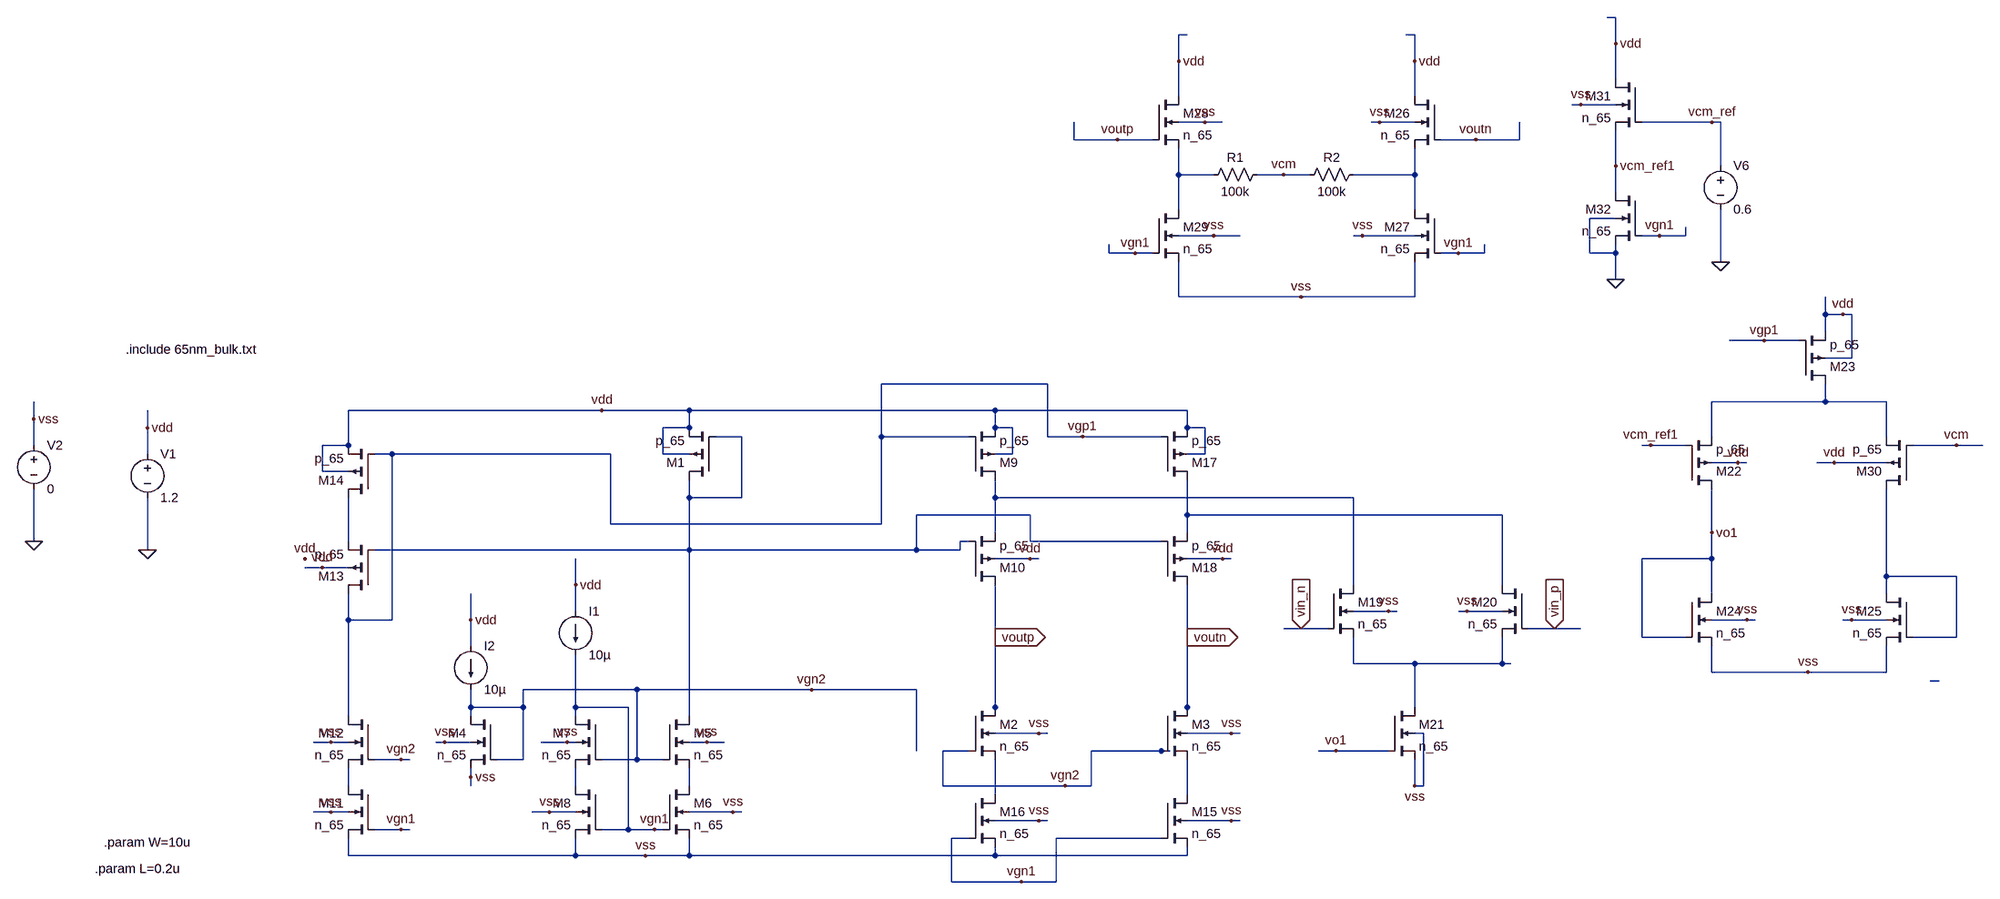
[diagram p0: schematic FC_OTA.asc]
FC_OTA.asc, the LTspice schematic file:
Version 4
SHEET 1 1988 1072
WIRE 1312 -944 1296 -944
WIRE 528 -912 512 -912
WIRE 944 -912 928 -912
WIRE 1312 -896 1312 -944
WIRE 512 -864 512 -912
WIRE 944 -864 944 -912
WIRE 1312 -832 1312 -896
WIRE 512 -800 512 -864
WIRE 944 -800 944 -864
WIRE 1248 -784 1232 -784
WIRE 1312 -784 1248 -784
WIRE 560 -752 512 -752
WIRE 592 -752 560 -752
WIRE 880 -752 864 -752
WIRE 944 -752 880 -752
WIRE 1488 -752 1360 -752
WIRE 1504 -752 1488 -752
WIRE 320 -720 320 -752
WIRE 400 -720 320 -720
WIRE 464 -720 400 -720
WIRE 1056 -720 992 -720
WIRE 1136 -720 1136 -752
WIRE 1136 -720 1056 -720
WIRE 1312 -672 1312 -736
WIRE 1504 -672 1504 -752
WIRE 512 -656 512 -704
WIRE 576 -656 512 -656
WIRE 704 -656 656 -656
WIRE 752 -656 704 -656
WIRE 944 -656 944 -704
WIRE 944 -656 832 -656
WIRE 1312 -624 1312 -672
WIRE 512 -592 512 -656
WIRE 944 -592 944 -656
WIRE 1312 -576 1264 -576
WIRE 576 -544 512 -544
WIRE 624 -544 576 -544
WIRE 848 -544 832 -544
WIRE 944 -544 848 -544
WIRE 1392 -544 1360 -544
WIRE 1440 -544 1440 -560
WIRE 1440 -544 1392 -544
WIRE 384 -512 384 -528
WIRE 432 -512 384 -512
WIRE 464 -512 432 -512
WIRE 1024 -512 992 -512
WIRE 1072 -512 1072 -528
WIRE 1072 -512 1024 -512
WIRE 1264 -512 1264 -576
WIRE 1312 -512 1312 -528
WIRE 1312 -512 1264 -512
WIRE 1504 -496 1504 -592
WIRE 1312 -464 1312 -512
WIRE 512 -432 512 -496
WIRE 736 -432 512 -432
WIRE 944 -432 944 -496
WIRE 944 -432 736 -432
WIRE 1696 -400 1696 -432
WIRE 1728 -400 1696 -400
WIRE 1744 -400 1728 -400
WIRE 1696 -368 1696 -400
WIRE 1584 -352 1520 -352
WIRE 1648 -352 1584 -352
WIRE 1744 -320 1744 -400
WIRE 1744 -320 1696 -320
WIRE 272 -272 -32 -272
WIRE 1696 -240 1696 -272
WIRE 1696 -240 1488 -240
WIRE 1808 -240 1696 -240
WIRE -544 -224 -1008 -224
WIRE -384 -224 -544 -224
WIRE 176 -224 -384 -224
WIRE 528 -224 176 -224
WIRE -1584 -208 -1584 -240
WIRE -1376 -192 -1376 -224
WIRE -384 -192 -384 -224
WIRE -384 -192 -432 -192
WIRE 176 -192 176 -224
WIRE 208 -192 176 -192
WIRE 528 -192 528 -224
WIRE 560 -192 528 -192
WIRE -288 -176 -336 -176
WIRE -32 -176 -32 -272
WIRE 128 -176 -32 -176
WIRE 272 -176 272 -272
WIRE 336 -176 272 -176
WIRE 480 -176 336 -176
WIRE 1488 -176 1488 -240
WIRE 1808 -176 1808 -240
WIRE -1584 -160 -1584 -208
WIRE -1008 -160 -1008 -224
WIRE -1008 -160 -1056 -160
WIRE 1376 -160 1360 -160
WIRE 1440 -160 1376 -160
WIRE 1936 -160 1856 -160
WIRE 1984 -160 1936 -160
WIRE -1376 -144 -1376 -192
WIRE -1008 -144 -1008 -160
WIRE -928 -144 -960 -144
WIRE -528 -144 -928 -144
WIRE -432 -144 -432 -192
WIRE -384 -144 -432 -144
WIRE 208 -144 208 -192
WIRE 208 -144 176 -144
WIRE 560 -144 560 -192
WIRE 560 -144 528 -144
WIRE 1536 -128 1488 -128
WIRE 1552 -128 1536 -128
WIRE 1712 -128 1680 -128
WIRE 1808 -128 1712 -128
WIRE -1056 -112 -1056 -160
WIRE -1008 -112 -1056 -112
WIRE -384 -64 -384 -96
WIRE -288 -64 -288 -176
WIRE -288 -64 -384 -64
WIRE 176 -64 176 -96
WIRE 832 -64 176 -64
WIRE 240 -32 32 -32
WIRE 528 -32 528 -96
WIRE 1104 -32 528 -32
WIRE -528 -16 -528 -144
WIRE -32 -16 -32 -176
WIRE -32 -16 -528 -16
WIRE 176 0 176 -64
WIRE 528 0 528 -32
WIRE 1488 0 1488 -80
WIRE -1584 16 -1584 -80
WIRE -1008 16 -1008 -64
WIRE 128 16 112 16
WIRE 240 16 240 -32
WIRE 480 16 240 16
WIRE -1376 32 -1376 -64
WIRE -384 32 -384 -64
WIRE -384 32 -960 32
WIRE 32 32 32 -32
WIRE 32 32 -384 32
WIRE 112 32 112 16
WIRE 112 32 32 32
WIRE 240 48 176 48
WIRE 256 48 240 48
WIRE 592 48 528 48
WIRE 608 48 592 48
WIRE 1488 48 1488 0
WIRE 1488 48 1360 48
WIRE -1056 64 -1088 64
WIRE -1008 64 -1056 64
WIRE 1808 80 1808 -80
WIRE 1936 80 1808 80
WIRE -592 96 -592 48
WIRE 832 96 832 -64
WIRE 1104 96 1104 -32
WIRE 1488 112 1488 48
WIRE 1808 112 1808 80
WIRE -592 144 -592 96
WIRE 896 144 832 144
WIRE 912 144 896 144
WIRE 1040 144 1024 144
WIRE 1104 144 1040 144
WIRE -1008 160 -1008 112
WIRE -928 160 -928 -144
WIRE -928 160 -1008 160
WIRE -784 160 -784 112
WIRE 1552 160 1488 160
WIRE 1568 160 1552 160
WIRE 1744 160 1728 160
WIRE 1808 160 1744 160
WIRE 736 176 704 176
WIRE 784 176 736 176
WIRE 1200 176 1152 176
WIRE 1248 176 1200 176
WIRE 176 192 176 96
WIRE 528 192 528 96
WIRE 1360 192 1360 48
WIRE 1440 192 1360 192
WIRE 1936 192 1936 80
WIRE 1936 192 1856 192
WIRE -784 208 -784 160
WIRE 832 240 832 192
WIRE 944 240 832 240
WIRE 1104 240 1104 192
WIRE 1104 240 944 240
WIRE 1120 240 1104 240
WIRE 1488 256 1488 208
WIRE 1664 256 1488 256
WIRE 1808 256 1808 208
WIRE 1808 256 1664 256
WIRE 1904 272 1888 272
WIRE -480 288 -688 288
WIRE -160 288 -480 288
WIRE 32 288 -160 288
WIRE -784 320 -784 288
WIRE -688 320 -688 288
WIRE -688 320 -784 320
WIRE -592 320 -592 224
WIRE -496 320 -592 320
WIRE 176 320 176 192
WIRE 528 320 528 192
WIRE 944 320 944 240
WIRE -1008 336 -1008 160
WIRE -784 336 -784 320
WIRE -592 336 -592 320
WIRE -384 336 -384 32
WIRE 176 336 176 320
WIRE 528 336 528 320
WIRE 256 368 176 368
WIRE 272 368 256 368
WIRE 608 368 528 368
WIRE 624 368 608 368
WIRE 960 368 944 368
WIRE -1040 384 -1072 384
WIRE -1008 384 -1040 384
WIRE -832 384 -848 384
WIRE -784 384 -832 384
WIRE -608 384 -656 384
WIRE -592 384 -608 384
WIRE -352 384 -384 384
WIRE -320 384 -352 384
WIRE 32 400 32 288
WIRE 128 400 80 400
WIRE 480 400 352 400
WIRE 496 400 480 400
WIRE 800 400 768 400
WIRE 896 400 800 400
WIRE -912 416 -960 416
WIRE -896 416 -912 416
WIRE -688 416 -688 320
WIRE -688 416 -736 416
WIRE -480 416 -480 288
WIRE -480 416 -544 416
WIRE -432 416 -480 416
WIRE -784 448 -784 432
WIRE -1008 464 -1008 432
WIRE -784 464 -784 448
WIRE -592 464 -592 432
WIRE -384 464 -384 432
WIRE 80 464 80 400
WIRE 304 464 80 464
WIRE 352 464 352 400
WIRE 352 464 304 464
WIRE 944 464 944 416
WIRE 960 464 960 368
WIRE 960 464 944 464
WIRE 176 480 176 416
WIRE 528 480 528 416
WIRE -1040 512 -1072 512
WIRE -1008 512 -1040 512
WIRE -640 512 -672 512
WIRE -592 512 -640 512
WIRE -304 512 -384 512
WIRE -288 512 -304 512
WIRE 256 528 176 528
WIRE 272 528 256 528
WIRE 608 528 528 528
WIRE 624 528 608 528
WIRE -912 544 -960 544
WIRE -896 544 -912 544
WIRE -496 544 -496 320
WIRE -496 544 -544 544
WIRE -448 544 -496 544
WIRE -432 544 -448 544
WIRE 128 560 96 560
WIRE 480 560 288 560
WIRE -1008 592 -1008 560
WIRE -592 592 -592 560
WIRE -592 592 -1008 592
WIRE -464 592 -592 592
WIRE -384 592 -384 560
WIRE -384 592 -464 592
WIRE 176 592 176 576
WIRE 176 592 -384 592
WIRE 528 592 528 576
WIRE 528 592 176 592
WIRE 96 640 96 560
WIRE 224 640 96 640
WIRE 288 640 288 560
WIRE 288 640 224 640
FLAG -592 96 vdd
FLAG 256 368 vss
FLAG 256 528 vss
FLAG -352 384 vss
FLAG -464 592 vss
FLAG -784 160 vdd
FLAG -784 448 vss
FLAG -608 384 vss
FLAG 240 48 vdd
FLAG -1040 384 vss
FLAG -912 544 vgn1
FLAG -912 416 vgn2
FLAG -544 -224 vdd
FLAG -1376 32 0
FLAG -1376 -192 vdd
FLAG -1584 16 0
FLAG -1584 -208 vss
FLAG 176 192 voutp
IOPIN 176 192 Out
FLAG 608 368 vss
FLAG 608 528 vss
FLAG 592 48 vdd
FLAG 528 192 voutn
IOPIN 528 192 Out
FLAG 896 144 vss
FLAG 1040 144 vss
FLAG 944 464 vss
FLAG 1664 256 vss
FLAG 1552 160 vss
FLAG 1744 160 vss
FLAG 1728 -400 vdd
FLAG 1536 -128 vdd
FLAG 1200 176 vin_p
IOPIN 1200 176 In
FLAG 736 176 vin_n
IOPIN 736 176 In
FLAG 336 -176 vgp1
FLAG -160 288 vgn2
FLAG 224 640 vgn1
FLAG 304 464 vgn2
FLAG 944 -864 vdd
FLAG 1024 -512 vgn1
FLAG 1056 -720 voutn
FLAG 512 -864 vdd
FLAG 432 -512 vgn1
FLAG 400 -720 voutp
FLAG 736 -432 vss
FLAG 704 -656 vcm
FLAG 1712 -128 vdd
FLAG 1936 -160 vcm
FLAG 1584 -352 vgp1
FLAG -448 544 vgn1
FLAG 1312 -896 vdd
FLAG 1392 -544 vgn1
FLAG 1504 -496 0
FLAG 1488 -752 vcm_ref
FLAG 1312 -672 vcm_ref1
FLAG 1376 -160 vcm_ref1
FLAG 1312 -464 0
FLAG 1488 0 vo1
FLAG 800 400 vo1
FLAG -1088 48 vdd
FLAG -1056 64 vdd
FLAG -304 512 vss
FLAG -640 512 vss
FLAG -832 384 vss
FLAG -1040 512 vss
FLAG 576 -544 vss
FLAG 848 -544 vss
FLAG 560 -752 vss
FLAG 880 -752 vss
FLAG 1248 -784 vss
DATAFLAG -48 288 ""
DATAFLAG 32 32 ""
DATAFLAG 288 -192 ""
DATAFLAG 528 -208 ""
DATAFLAG 1536 -240 ""
DATAFLAG 1488 -32 ""
DATAFLAG 1808 32 ""
DATAFLAG 176 144 ""
DATAFLAG 528 144 ""
DATAFLAG 1680 192 ""
DATAFLAG 944 -32 ""
DATAFLAG 256 -64 ""
DATAFLAG 528 464 ""
DATAFLAG 176 464 ""
DATAFLAG 944 448 ""
DATAFLAG 144 560 ""
DATAFLAG 384 16 ""
DATAFLAG 368 544 ""
DATAFLAG 512 -688 ""
DATAFLAG 944 -672 ""
DATAFLAG 336 -720 ""
DATAFLAG 1136 -736 ""
DATAFLAG -944 416 ""
DATAFLAG -944 544 ""
DATAFLAG -528 416 ""
DATAFLAG -528 544 ""
DATAFLAG -640 -144 ""
DATAFLAG -688 32 ""
DATAFLAG -1008 -48 ""
DATAFLAG 1424 -768 ""
DATAFLAG 1472 80 ""
DATAFLAG 832 -16 ""
DATAFLAG 944 288 ""
DATAFLAG 816 384 ""
DATAFLAG 528 144 ""
DATAFLAG 176 240 "$"
DATAFLAG 880 -32 "$"
DATAFLAG 688 -64 "$"
SYMBOL pmos4 -336 -96 R180
SYMATTR InstName M1
SYMATTR Value p_65
SYMATTR Value2 l={L} w=0.25*{W}
SYMBOL nmos4 128 320 R0
SYMATTR InstName M2
SYMATTR Value n_65
SYMATTR Value2 l={L} w={W}
SYMBOL current -592 144 R0
WINDOW 123 0 0 Left 0
WINDOW 39 0 0 Left 0
SYMATTR InstName I1
SYMATTR Value 10µ
SYMBOL current -784 208 R0
WINDOW 123 0 0 Left 0
WINDOW 39 0 0 Left 0
SYMATTR InstName I2
SYMATTR Value 10µ
SYMBOL pmos4 128 -96 M180
SYMATTR InstName M9
SYMATTR Value p_65
SYMATTR Value2 l={L} w=2*{W}
SYMBOL pmos4 128 96 M180
SYMATTR InstName M10
SYMATTR Value p_65
SYMATTR Value2 l={L} w={W}
SYMBOL voltage -1376 -160 R0
WINDOW 123 0 0 Left 0
WINDOW 39 0 0 Left 0
SYMATTR InstName V1
SYMATTR Value 1.2
SYMBOL voltage -1584 -176 R0
WINDOW 123 0 0 Left 0
WINDOW 39 0 0 Left 0
SYMATTR InstName V2
SYMATTR Value 0
SYMBOL pmos4 480 -96 M180
SYMATTR InstName M17
SYMATTR Value p_65
SYMATTR Value2 l={L} w=2*{W}
SYMBOL nmos4 784 96 R0
SYMATTR InstName M19
SYMATTR Value n_65
SYMATTR Value2 l=200n w=80u
SYMBOL nmos4 1152 96 M0
SYMATTR InstName M20
SYMATTR Value n_65
SYMATTR Value2 l=200n w=80u
SYMBOL nmos4 896 320 R0
SYMATTR InstName M21
SYMATTR Value n_65
SYMATTR Value2 l={L} w=2*{W}
SYMBOL pmos4 1440 -80 M180
SYMATTR InstName M22
SYMATTR Value p_65
SYMATTR Value2 l=65n w=40u
SYMBOL nmos4 992 -800 M0
SYMATTR InstName M26
SYMATTR Value n_65
SYMATTR Value2 l=65n w=20u
SYMBOL nmos4 992 -592 M0
SYMATTR InstName M27
SYMATTR Value n_65
SYMATTR Value2 l=200n w=20u
SYMBOL nmos4 464 -800 R0
SYMATTR InstName M28
SYMATTR Value n_65
SYMATTR Value2 l=65n w=20u
SYMBOL nmos4 464 -592 R0
SYMATTR InstName M29
SYMATTR Value n_65
SYMATTR Value2 l=200n w=20u
SYMBOL res 672 -672 R90
WINDOW 0 0 56 VBottom 2
WINDOW 3 32 56 VTop 2
SYMATTR InstName R1
SYMATTR Value 100k
SYMATTR SpiceLine tol=1 pwr=0.1
SYMBOL res 848 -672 R90
WINDOW 0 0 56 VBottom 2
WINDOW 3 32 56 VTop 2
SYMATTR InstName R2
SYMATTR Value 100k
SYMATTR SpiceLine tol=1 pwr=0.1
SYMBOL pmos4 1856 -80 R180
SYMATTR InstName M30
SYMATTR Value p_65
SYMATTR Value2 l=65n w=40u
SYMBOL nmos4 1360 -832 M0
SYMATTR InstName M31
SYMATTR Value n_65
SYMATTR Value2 l=65n w=20u
SYMBOL nmos4 1360 -624 M0
SYMATTR InstName M32
SYMATTR Value n_65
SYMATTR Value2 l=200n w=20u
SYMBOL voltage 1504 -688 R0
WINDOW 123 0 0 Left 0
WINDOW 39 0 0 Left 0
SYMATTR InstName V6
SYMATTR Value 0.6
SYMBOL pmos4 480 96 M180
SYMATTR InstName M18
SYMATTR Value p_65
SYMATTR Value2 l={L} w={W}
SYMBOL nmos4 480 320 R0
SYMATTR InstName M3
SYMATTR Value n_65
SYMATTR Value2 l={L} w={W}
SYMBOL nmos4 480 480 R0
SYMATTR InstName M15
SYMATTR Value n_65
SYMATTR Value2 l={L} w={W}
SYMBOL nmos4 128 480 R0
SYMATTR InstName M16
SYMATTR Value n_65
SYMATTR Value2 l={L} w={W}
SYMBOL nmos4 -432 336 R0
SYMATTR InstName M5
SYMATTR Value n_65
SYMATTR Value2 l={L} w={W}
SYMBOL nmos4 -432 464 R0
SYMATTR InstName M6
SYMATTR Value n_65
SYMATTR Value2 l={L} w={W}
SYMBOL nmos4 -736 336 M0
SYMATTR InstName M4
SYMATTR Value n_65
SYMATTR Value2 l={L} w=0.25*{W}
SYMBOL nmos4 -544 336 M0
SYMATTR InstName M7
SYMATTR Value n_65
SYMATTR Value2 l={L} w={W}
SYMBOL nmos4 -544 464 M0
SYMATTR InstName M8
SYMATTR Value n_65
SYMATTR Value2 l={L} w={W}
SYMBOL nmos4 -960 464 M0
SYMATTR InstName M11
SYMATTR Value n_65
SYMATTR Value2 l={L} w={W}
SYMBOL nmos4 -960 336 M0
SYMATTR InstName M12
SYMATTR Value n_65
SYMATTR Value2 l={L} w={W}
SYMBOL pmos4 -960 112 R180
SYMATTR InstName M13
SYMATTR Value p_65
SYMATTR Value2 l={L} w={W}
SYMBOL pmos4 -960 -64 R180
SYMATTR InstName M14
SYMATTR Value p_65
SYMATTR Value2 l={L} w={W}
SYMBOL pmos4 1648 -272 M180
SYMATTR InstName M23
SYMATTR Value p_65
SYMATTR Value2 l={L} w=2*{W}
SYMBOL nmos4 1440 112 R0
SYMATTR InstName M24
SYMATTR Value n_65
SYMATTR Value2 l={L} w={W}
SYMBOL nmos4 1856 112 M0
SYMATTR InstName M25
SYMATTR Value n_65
SYMATTR Value2 l={L} w={W}
TEXT -1416 -336 Left 2 !.include 65nm_bulk.txt
TEXT -1456 568 Left 2 !.param W=10u
TEXT -1472 616 Left 2 !.param L=0.2u

The netlist it stands for:
* FC_OTA.asc
M1 N004 N004 vdd vdd p_65 l={L} w=0.25*{W}
M2 voutp vgn2 N014 vss n_65 l={L} w={W}
I1 vdd vgn1 10µ
I2 vdd vgn2 10µ
M9 N005 vgp1 vdd vdd p_65 l={L} w=2*{W}
M10 voutp N004 N005 vdd p_65 l={L} w={W}
V1 vdd 0 1.2
V2 vss 0 0
M17 N006 vgp1 vdd vdd p_65 l={L} w=2*{W}
M19 N005 vin_n N009 vss n_65 l=200n w=80u
M20 N006 vin_p N009 vss n_65 l=200n w=80u
M21 N009 vo1 vss vss n_65 l={L} w=2*{W}
M22 vo1 vcm_ref1 N003 vdd p_65 l=65n w=40u
M26 vdd voutn N002 vss n_65 l=65n w=20u
M27 N002 vgn1 vss vss n_65 l=200n w=20u
M28 vdd voutp N001 vss n_65 l=65n w=20u
M29 N001 vgn1 vss vss n_65 l=200n w=20u
R1 vcm N001 100k tol=1 pwr=0.1
R2 N002 vcm 100k tol=1 pwr=0.1
M30 N008 vcm N003 vdd p_65 l=65n w=40u
M31 vdd vcm_ref vcm_ref1 vss n_65 l=65n w=20u
M32 vcm_ref1 vgn1 0 0 n_65 l=200n w=20u
V6 vcm_ref 0 0.6
M18 voutn N004 N006 vdd p_65 l={L} w={W}
M3 voutn vgn2 N015 vss n_65 l={L} w={W}
M15 N015 vgn1 vss vss n_65 l={L} w={W}
M16 N014 vgn1 vss vss n_65 l={L} w={W}
M5 N004 vgn2 N013 vss n_65 l={L} w={W}
M6 N013 vgn1 vss vss n_65 l={L} w={W}
M4 vgn2 vgn2 vss vss n_65 l={L} w=0.25*{W}
M7 vgn1 vgn2 N012 vss n_65 l={L} w={W}
M8 N012 vgn1 vss vss n_65 l={L} w={W}
M11 N011 vgn1 vss vss n_65 l={L} w={W}
M12 vgp1 vgn2 N011 vss n_65 l={L} w={W}
M13 vgp1 N004 N007 vdd p_65 l={L} w={W}
M14 N007 vgp1 vdd vdd p_65 l={L} w={W}
M23 N003 vgp1 vdd vdd p_65 l={L} w=2*{W}
M24 vo1 vo1 vss vss n_65 l={L} w={W}
M25 N008 N008 vss vss n_65 l={L} w={W}
.model NMOS NMOS
.model PMOS PMOS
.lib standard.mos
.include 65nm_bulk.txt
.param W=10u
.param L=0.2u
.backanno
.end